# EAGLE design IR_module_V4 (EAGLE 7.2.0)
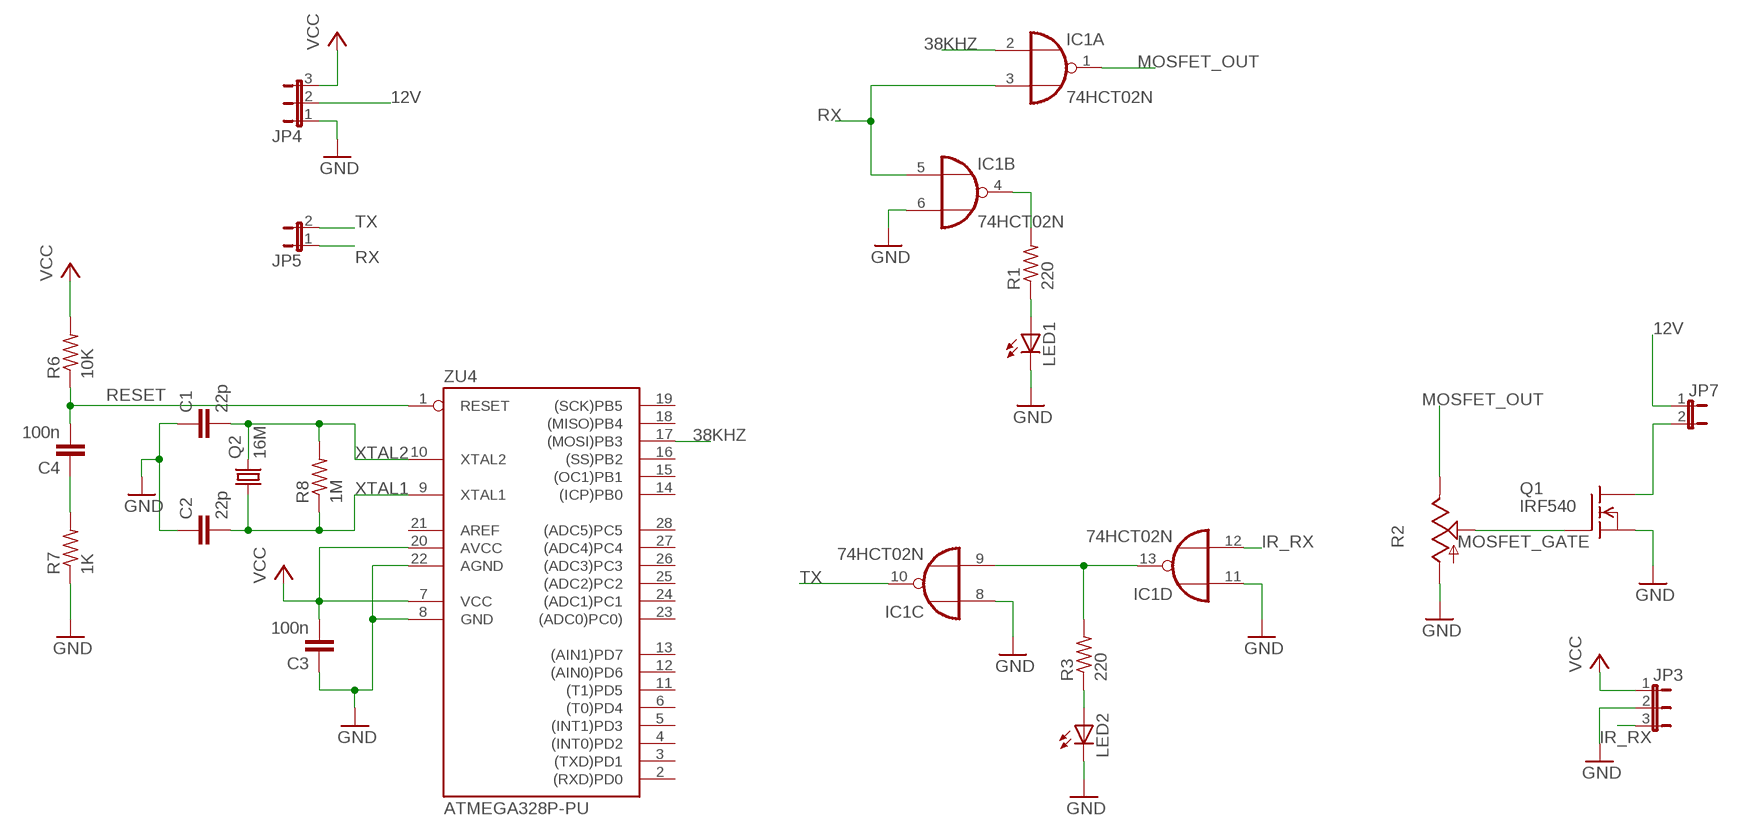
[diagram p0: schematic, sheet 1]

## Parts
C1  22p  CAPEZ  [CAP-PTH-SMALLEZ]
C2  22p  CAPEZ  [CAP-PTH-SMALLEZ]
C3  100n  CAPEZ  [CAP-PTH-SMALLEZ]
C4  100n  CAPEZ  [CAP-PTH-SMALLEZ]
IC1  74HCT02N  [DIL14]
JP3  JP2E  [JP2]
JP4  JP2E  [JP2]
JP5  JP1E  [JP1]
JP7  JP1E  [JP1]
LED1  LED5MM  [LED5MM]
LED2  LED5MM  [LED5MM]
Q1  IRF540  [TO220]
Q2  16M  CRYSTALHC49S  [HC49/S]
R1  220  R-US_0207/10  [0207/10]
R2  TRIM_US-B25P  [B25P]
R3  220  R-US_0207/10  [0207/10]
R6  10K  R-US_0207/10  [0207/10]
R7  1K  R-US_0207/10  [0207/10]
R8  1M  R-US_0207/10  [0207/10]
ZU4  ATMEGA328P-PU  [DIL28-3]

## Nets
12V: JP4.2 JP7.1
38KHZ: IC1.2(A:I0) ZU4.17((MOSI)PB3)
GND [gnd]: C1.1 C2.1 C3.1 IC1.6(B:I1) IC1.8(C:I0) IC1.11(D:I0) JP3.2 JP4.1 LED1.K(C) LED2.K(C) Q1.3(S) R2.A R7.1 ZU4.8(GND) ZU4.22(AGND)
IR_RX: IC1.12(D:I1) JP3.3
MOSFET_GATE: Q1.1(G) R2.S
MOSFET_OUT: IC1.1(A:O) R2.E
N$2: IC1.4(B:O) R1.2
N$3: LED1.A R1.1
N$4: IC1.9(C:I1) IC1.13(D:O) R3.2
N$5: LED2.A R3.1
N$8: JP7.2 Q1.2(D)
N$9: C4.1 R7.2
RESET: C4.2 R6.1 ZU4.1(RESET)
RX: IC1.3(A:I1) IC1.5(B:I0) JP5.1
TX: IC1.10(C:O) JP5.2
VCC: C3.2 JP3.1 JP4.3 R6.2 ZU4.7(VCC) ZU4.20(AVCC)
XTAL1: C2.2 Q2.1 R8.1 ZU4.9(XTAL1)
XTAL2: C1.2 Q2.2 R8.2 ZU4.10(XTAL2)
Unconnected: ZU4.2((RXD)PD0) ZU4.3((TXD)PD1) ZU4.4((INT0)PD2) ZU4.5((INT1)PD3) ZU4.6((T0)PD4) ZU4.11((T1)PD5) ZU4.12((AIN0)PD6) ZU4.13((AIN1)PD7) ZU4.14((ICP)PB0) ZU4.15((OC1)PB1) ZU4.16((SS)PB2) ZU4.18((MISO)PB4) ZU4.19((SCK)PB5) ZU4.21(AREF) ZU4.23((ADC0)PC0)) ZU4.24((ADC1)PC1) ZU4.25((ADC2)PC2) ZU4.26((ADC3)PC3) ZU4.27((ADC4)PC4) ZU4.28((ADC5)PC5)

## Power pins joined to a net without a drawn wire
GND: IC1.7(P:GND)
VCC: IC1.14(P:VCC)

## Library data of the parts
C1-C4 = SparkFun-Capacitors:CAP: Capacitor Standard 0603 ceramic capacitor, and 0.1" leaded capacitor.
IC1 = 74xx-eu:74*02: Quad 2-input NOR gate
JP3 JP4 = jumper:JP2E: JUMPER
JP5 JP7 = jumper:JP1E: JUMPER
LED1 LED2 = led:LED: LED OSRAM: - CHIPLED LG R971, LG N971, LY N971, LG Q971, LY Q971, LO R971, LY R971 LH N974, LH R974 LS Q976, LO Q976, LY Q976 LO Q996 - Hyper CHIPLED LW Q18S LB Q993, LB Q99A, LB R99A - SideLED LS A670, LO A670, LY A670, LG A670, LP A670 LB A673, LV A673, LT A673, LW A673 LH A674 LY A675 LS A676, LA A676, LO A676, LY A676, LW A676 LS A679, LY A679, LG A679 - Hyper Micro SIDELED® LS Y876, LA Y876, LO Y876, LY Y876 LT Y87S - SmartLED LW L88C, LW L88S LB L89C, LB L89S, LG L890 LS L89K, LO L89K, LY L89K LS L896, LA L896, LO L896, LY L896 - TOPLED LS T670, LO T670, LY T670, LG T670, LP T670 LSG T670, LSP T670, LSY T670, LOP T670, LYG T670 LG T671, LOG T671, LSG T671 LB T673, LV T673, LT T673, LW T673 LH T674 LS T676, LA T676, LO T676, LY T676, LB T676, LH T676, LSB T676, LW T676 LB T67C, LV T67C, LT T67C, LS T67K, LO T67K, LY T67K, LW E67C LS E67B, LA E67B, LO E67B, LY E67B, LB E67C, LV E67C, LT E67C LW T67C LS T679, LY T679, LG T679 LS T770, LO T770, LY T770, LG T770, LP T770 LB T773, LV T773, LT T773, LW T773 LH T774 LS E675, LA E675, LY E675, LS T675 LS T776, LA T776, LO T776, LY T776, LB T776 LHGB T686 LT T68C, LB T68C - Hyper Mini TOPLED® LB M676 - Mini TOPLED Santana® LG M470 LS M47K, LO M47K, LY M47K Source: http://www.osram.convergy.de LUXEON: - LUMILED® LXK2-PW12-R00, LXK2-PW12-S00, LXK2-PW14-U00, LXK2-PW14-V00 LXK2-PM12-R00, LXK2-PM12-S00, LXK2-PM14-U00 LXK2-PE12-Q00, LXK2-PE12-R00, LXK2-PE12-S00, LXK2-PE14-T00, LXK2-PE14-U00 LXK2-PB12-K00, LXK2-PB12-L00, LXK2-PB12-M00, LXK2-PB14-N00, LXK2-PB14-P00, LXK2-PB14-Q00 LXK2-PR12-L00, LXK2-PR12-M00, LXK2-PR14-Q00, LXK2-PR14-R00 LXK2-PD12-Q00, LXK2-PD12-R00, LXK2-PD12-S00 LXK2-PH12-R00, LXK2-PH12-S00 LXK2-PL12-P00, LXK2-PL12-Q00, LXK2-PL12-R00 Source: www.luxeon.com KINGBRIGHT: KA-3528ASYC Source: www.kingbright.com
Q1 = transistor-fet:IRF540: N-Channel Enhancement MOSFET (HEXFET); 100V; 28A; 0,077Ohm
Q2 = crystal:CRYSTAL: CRYSTAL; OC_FARNELL: 1667008; OC_NEWARK: unknown
R1 R3 R6-R8 = rcl:R-US_: RESISTOR, American symbol
R2 = pot:TRIM_US-: POTENTIOMETER
ZU4 = SmartPrj:ATMEGA328P-: MICROCONTROLLER 4 Kbytes FLASH 128 bytes SRAM 256 bytes EEPROM UART 6-channel 10 bit ADC

## Net classes
0 default: width 0.254 mm, clearance 0.254 mm
1 power: width 0.61 mm, drill 0.61 mm, clearance 0.254 mm
2 gnd: width 0.305 mm, drill 0.559 mm, clearance 0.254 mm
3 usbvcc: width 0.508 mm, drill 0.61 mm, clearance 0.254 mm
4 aref: width 0.406 mm, drill 0.61 mm, clearance 0.254 mm

## Board
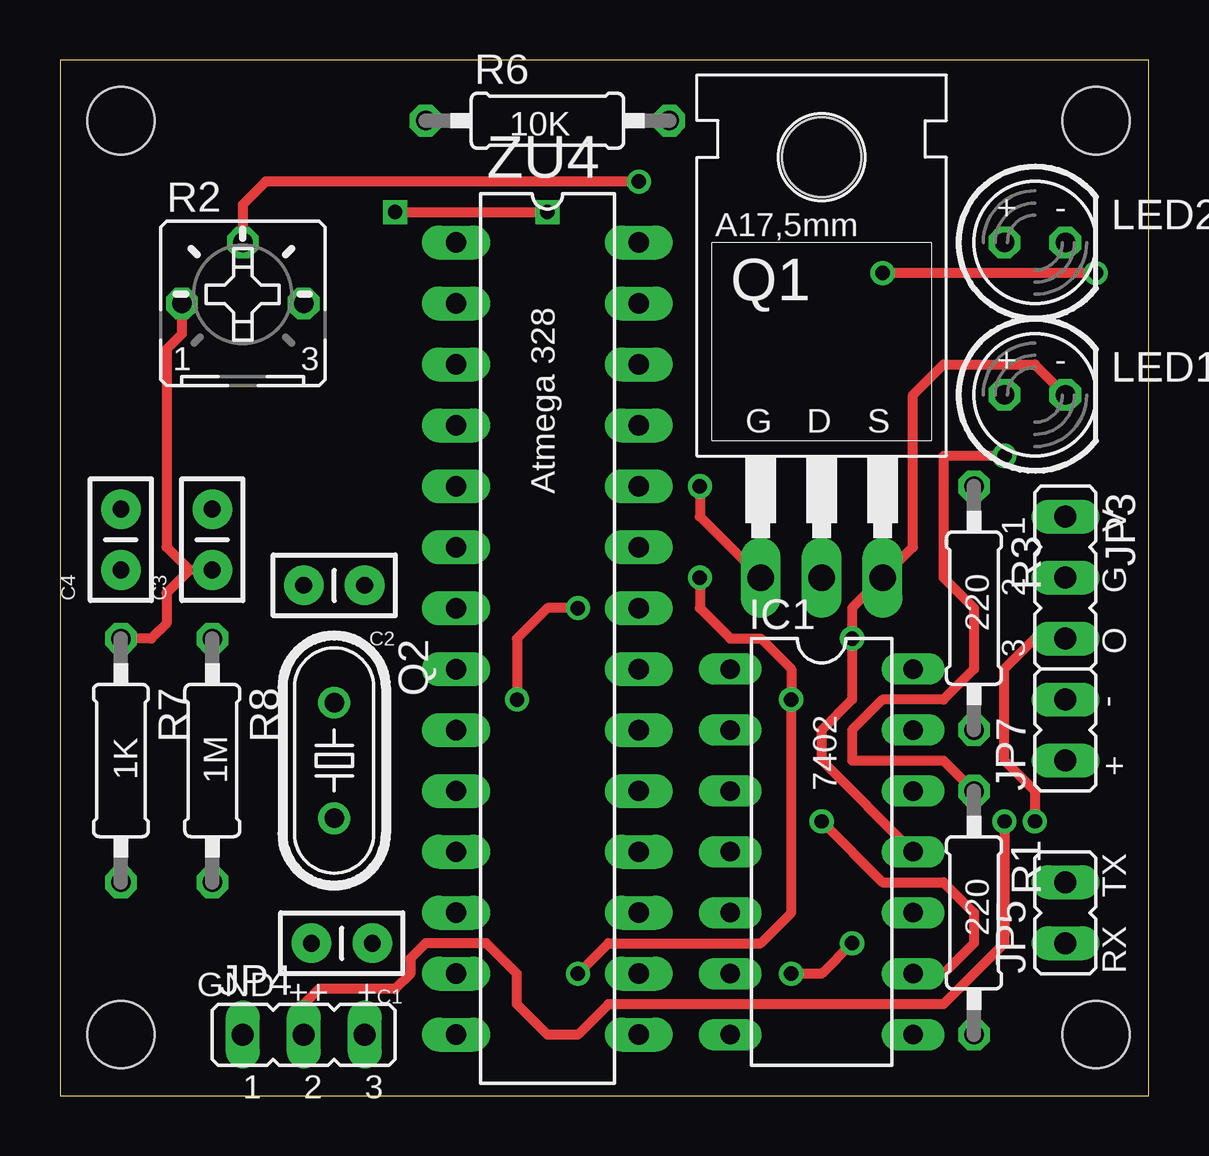
[diagram p1: board, top side]
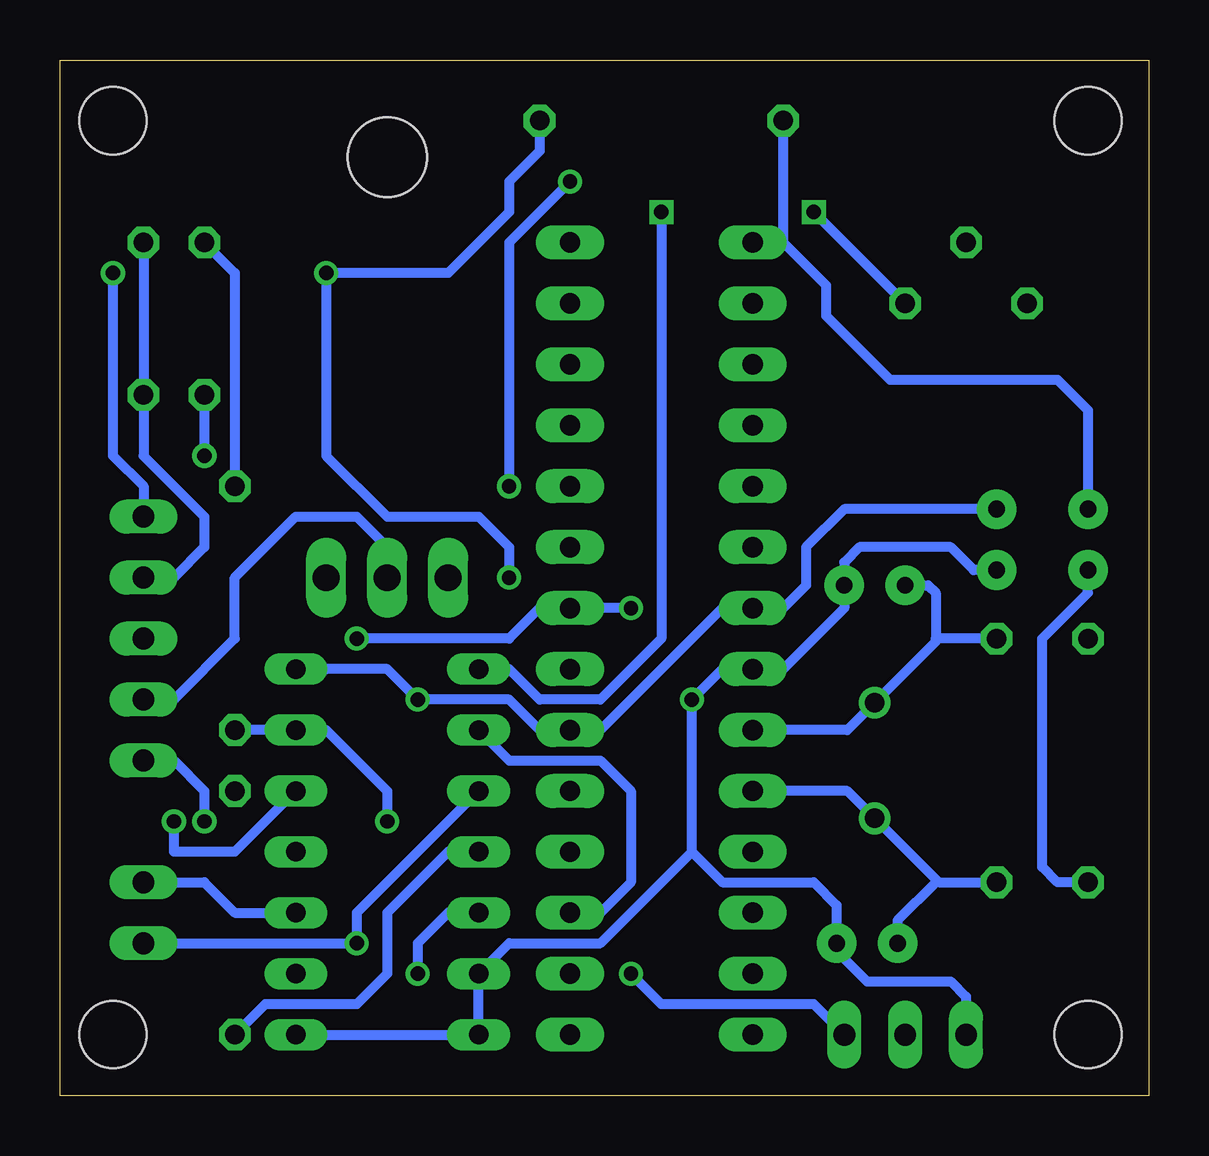
[diagram p2: board, bottom side, seen from below]

Size 45.39 x 43.17 mm. Coordinates in mm from the lower left corner, seen from the top.
Outline: 0,0 45.39,0 45.39,43.17 0,43.17 0,0
Copper layers (1*16): Top 0.035mm / dielectric 1.5mm / Bottom 0.035mm
Design rules "default": minimum track width 10mil, minimum drill 24mil, track to track 8mil, track to pad 8mil, pad to pad 8mil, via to via 8mil, smd to smd 8mil, copper to edge 40mil, drill to drill 8mil, minimum pad ring 10mil, minimum via ring 8mil, stop-mask expansion 4mil, vias tented up to drill 0mil, thermal gap 10mil
Holes 2.8 mm at 2.54,40.64 43.18,2.54 2.54,2.54 43.18,40.64

### Footprints (pad centres in the part's own frame; a part is rotated, then mirrored left to right if it is on the bottom)
CAP-PTH-SMALLEZ = drill 0.7 pad 1.651: 1 0,0; 2 2.54,0
DIL14 = drill 0.813 long: 1 -7.62,-3.81; 2 -5.08,-3.81; 3 -2.54,-3.81; 4 0,-3.81; 5 2.54,-3.81; 6 5.08,-3.81; 7 7.62,-3.81; 8 7.62,3.81; 9 5.08,3.81; 10 2.54,3.81; 11 0,3.81; 12 -2.54,3.81; 13 -5.08,3.81; 14 -7.62,3.81
JP2 = drill 0.914 long: 1 -2.54,0; 2 0,0; 3 2.54,0
JP1 = drill 0.914 long: 1 0,-1.27; 2 0,1.27
LED5MM = drill 0.813 octagon: A -1.27,0; K 1.27,0
TO220 = drill 1.118 long: 1 -2.54,-6.35; 2 0,-6.35; 3 2.54,-6.35 | hole 3.302: 0,11.176
HC49/S = drill 0.813: 1 -2.413,0; 2 2.413,0
0207/10 = drill 0.813 octagon: 1 -5.08,0; 2 5.08,0
B25P = drill 0.813 octagon: A -2.54,0; E 2.54,0; S 0,2.54
DIL28-3 = drill 0.85 pad 1.422 long: 1 -16.51,-3.81; 2 -13.97,-3.81; 3 -11.43,-3.81; 4 -8.89,-3.81; 5 -6.35,-3.81; 6 -3.81,-3.81; 7 -1.27,-3.81; 8 1.27,-3.81; 9 3.81,-3.81; 10 6.35,-3.81; 11 8.89,-3.81; 12 11.43,-3.81; 13 13.97,-3.81; 14 16.51,-3.81; 15 16.51,3.81; 16 13.97,3.81; 17 11.43,3.81; 18 8.89,3.81; 19 6.35,3.81; 20 3.81,3.81; 21 1.27,3.81; 22 -1.27,3.81; 23 -3.81,3.81; 24 -6.35,3.81; 25 -8.89,3.81; 26 -11.43,3.81; 27 -13.97,3.81; 28 -16.51,3.81

### Placement (x,y rotation side)
C1  13.02,6.35 180 top
C2  12.7,21.27 180 top
C3  6.35,21.91 90 top
C4  2.54,21.91 90 top
IC1  31.75,10.16 270 top
JP3  41.91,21.59 270 top
JP4  10.16,2.54 0 top
JP5  41.91,7.62 0 top
JP7  41.91,15.24 0 top
LED1  40.64,29.21 0 top
LED2  40.64,35.56 0 top
Q1  31.75,27.94 0 top
Q2  11.43,13.97 270 top
R1  38.1,7.62 270 top
R2  7.62,33.02 0 top
R3  38.1,20.32 270 top
R6  20.32,40.64 0 top
R7  2.54,13.97 270 top
R8  6.35,13.97 270 top
ZU4  20.32,19.05 270 top

### Tracks (layer width: path | path; a pad name or v marks a point on that pad's centre or on a via)
12V  (via drill 0.6)
  Top 0.406: v39.37,11.43 39.37,6.35 36.83,3.81 22.86,3.81 21.59,2.54 20.32,2.54 19.05,3.81 19.05,5.08 17.78,6.35 15.24,6.35 14.61,5.71 14.61,5.08 13.97,4.45 10.79,4.45 10.16,3.81 JP4.2
  Bottom 0.406: JP7.1 40.64,13.97 39.37,12.7 v39.37,11.43
38KHZ
  Bottom 0.406: IC1.2 26.67,13.97 22.86,13.97 21.59,12.7 21.59,8.89 22.86,7.62 ZU4.17
GND  (via drill 0.6)
  Top 0.406: IC1.11 31.75,13.97 31.75,15.24 33.02,16.51 v33.02,19.05 33.02,20.32 Q1.3 35.56,22.86 35.56,29.21 36.83,30.48 40.64,30.48 LED1.K | v21.59,20.32 20.32,20.32 19.05,19.05 v19.05,16.51 | R2.A 5.08,31.75 4.45,31.11 4.45,22.86 5.4,21.91 | C3.1 5.4,21.91 | 5.4,21.91 4.45,20.95 4.45,19.68 3.81,19.05 R7.1
  Bottom 0.406: LED2.K LED1.K 41.91,26.67 39.37,24.13 39.37,22.86 40.64,21.59 JP3.2 | 19.05,10.16 v19.05,16.51 17.78,17.78 ZU4.8 15.24,17.78 12.7,20.32 C2.1 12.7,22.23 12.06,22.86 8.26,22.86 7.3,21.91 C3.1 | v21.59,20.32 ZU4.22 25.4,20.32 26.67,19.05 v33.02,19.05 | IC1.8 IC1.7 IC1.6 26.67,6.35 22.86,6.35 19.05,10.16 | 19.05,10.16 17.78,8.89 13.97,8.89 13.02,7.94 C1.1 13.02,6.03 11.75,4.76 8.26,4.76 7.62,4.13 JP4.1
IR_RX  (via drill 0.6)
  Top 0.406: v40.64,11.43 40.64,12.7 39.37,13.97 39.37,17.78 40.64,19.05 JP3.3
  Bottom 0.406: IC1.12 38.1,10.16 40.64,10.16 v40.64,11.43
MOSFET_GATE  (via drill 0.6)
  Top 0.406: v26.67,25.4 26.67,24.13 Q1.1 | v24.13,38.1 8.57,38.1 7.62,37.15 R2.S
  Bottom 0.406: v26.67,25.4 26.67,35.56 v24.13,38.1
MOSFET_OUT  (via drill 0.6)
  Top 0.406: v13.97,36.83 v20.32,36.83
  Bottom 0.406: R2.E v13.97,36.83 | v20.32,36.83 20.32,19.05 22.86,16.51 25.4,16.51 26.67,17.78 IC1.1
N$2
  Bottom 0.406: IC1.4 29.21,10.16 31.75,7.62 31.75,5.08 33.02,3.81 36.83,3.81 R1.2
N$3  (via drill 0.6)
  Top 0.406: v39.37,26.67 36.83,26.67 36.83,21.59 38.1,20.32 38.1,17.78 36.83,16.51 34.29,16.51 33.02,15.24 33.02,13.97 36.83,13.97 R1.1
  Bottom 0.406: LED1.A v39.37,26.67
N$4  (via drill 0.6)
  Top 0.406: IC1.9 36.83,5.08 38.1,6.35 38.1,7.62 36.83,8.89 34.29,8.89 v31.75,11.43
  Bottom 0.406: R3.2 IC1.13 34.29,15.24 31.75,12.7 v31.75,11.43
N$5
  Bottom 0.406: LED2.A 38.1,34.29 R3.1
N$8
  Bottom 0.406: JP7.2 40.64,16.51 38.1,19.05 38.1,21.59 35.56,24.13 33.02,24.13 31.75,22.86 Q1.2
N$9
  Bottom 0.406: R7.2 3.81,8.89 4.45,9.53 4.45,19.05 2.54,20.95 C4.1
RESET
  Bottom 0.406: 15.24,35.56 13.46,33.78 13.46,32.51 10.79,29.84 3.81,29.84 2.54,28.57 C4.2 | 15.24,35.56 ZU4.1 | 15.24,35.56 R6.1
RX  (via drill 0.6)
  Top 0.406: v30.48,5.08 31.75,5.08 v33.02,6.35
  Bottom 0.406: JP5.1 v33.02,6.35 33.02,7.62 IC1.3 | v30.48,5.08 30.48,6.35 29.21,7.62 IC1.5
TX
  Bottom 0.406: JP5.2 39.37,8.89 38.1,7.62 IC1.10
VCC  (via drill 0.6)
  Top 0.406: v21.59,5.08 22.86,6.35 29.21,6.35 30.48,7.62 v30.48,16.51 30.48,17.78 29.21,19.05 27.94,19.05 26.67,20.32 v26.67,21.59 | v43.18,34.29 v34.29,34.29
  Bottom 0.406: R6.2 25.4,39.37 26.67,38.1 26.67,36.83 29.21,34.29 v34.29,34.29 34.29,26.67 31.75,24.13 27.94,24.13 26.67,22.86 v26.67,21.59 | 34.29,17.78 IC1.14 31.75,17.78 v30.48,16.51 26.67,16.51 25.4,15.24 ZU4.20 22.86,15.24 17.78,20.32 ZU4.7 15.24,20.32 14.29,21.27 14.29,22.86 12.7,24.45 C3.2 | JP4.3 13.97,3.81 20.32,3.81 v21.59,5.08 | v43.18,34.29 43.18,26.67 41.91,25.4 JP3.1
XTAL1
  Bottom 0.406: ZU4.9 12.57,15.24 Q2.1 8.89,18.92 8.89,19.05 | R8.1 8.89,19.05 | C2.2 9.21,21.27 8.89,20.95 8.89,19.05
XTAL2
  Bottom 0.406: ZU4.10 12.57,12.7 Q2.2 8.76,8.89 | 8.76,8.89 R8.2 | 8.76,8.89 8.89,8.89 10.48,7.3 C1.2

### Text on the board
tPlace: 10K | + - | + - | G | D | S | Atmega 328 | V | G | 220 | O | - | 1K | 1M | 7402 | + | TX | 220 | RX | GND | ++ | +